# Altium schematic sheet part_2.SchDoc
size A4; SheetNumber: 2; SheetTotal: 2
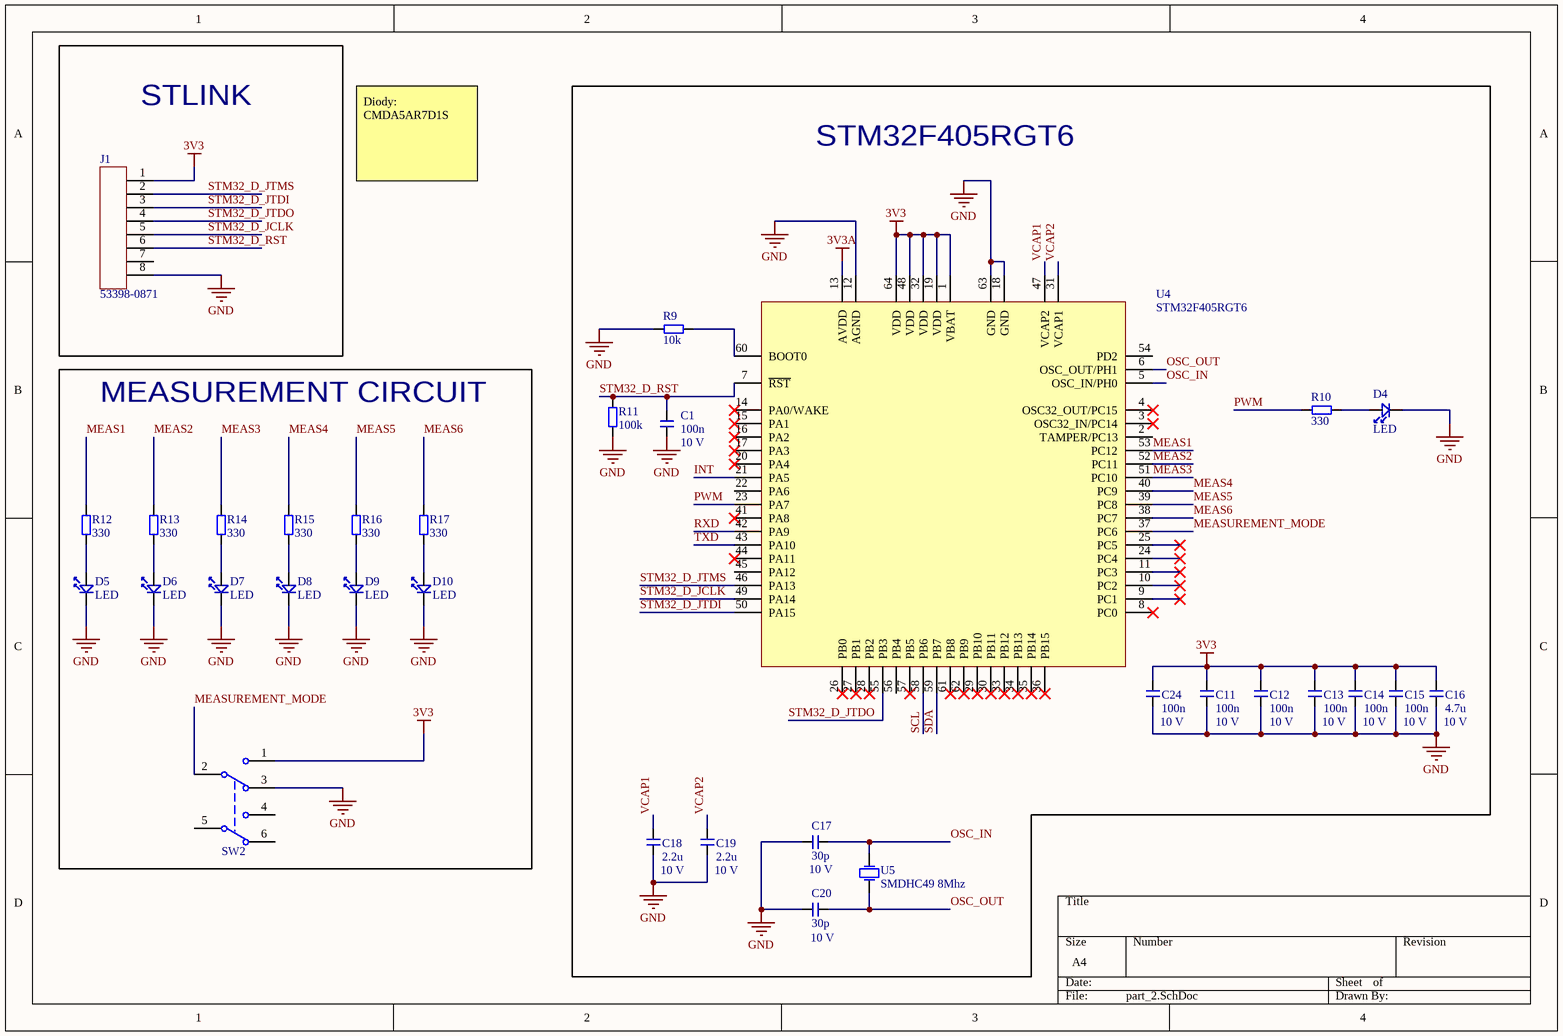
[diagram p0: part_2.SchDoc]

## Parts
C1  100n  V: 10 V  [0603]
C11  100n  V: 10 V  [0603]
C12  100n  V: 10 V  [0603]
C13  100n  V: 10 V  [0603]
C14  100n  V: 10 V  [0603]
C15  100n  V: 10 V  [0603]
C16  4.7u  V: 10 V  [0603]
C17  30p  V: 10 V  [0603]
C18  2.2u  V: 10 V  [0603]
C19  2.2u  V: 10 V  [0603]
C20  30p  V: 10 V  [0603]
C24  100n  V: 10 V  [0603]
D4  LED  [Dioda_0805]
D5  LED  [Dioda_0805]
D6  LED  [Dioda_0805]
D7  LED  [Dioda_0805]
D8  LED  [Dioda_0805]
D9  LED  [Dioda_0805]
D10  LED  [Dioda_0805]
J1  53398-0871  [53398-0871]
R9  10k  [0603]
R10  330  [0603]
R11  100k  [0603]
R12  330  [0603]
R13  330  [0603]
R14  330  [0603]
R15  330  [0603]
R16  330  [0603]
R17  330  [0603]
SW2  452403012014  [452403012014]  (value not drawn)
U4  STM32F405RGT6  [LQFP 64 0.5]
U5  SMDHC49 8Mhz  [SMDHC_49]

## Blocks framed on the sheet
STLINK: J1
STM32F405RGT6: C1 C11-C20 C24 D4 R9-R11 U4 U5
MEASUREMENT CIRCUIT: D5-D10 R12-R17 SW2

## Nets
3V3: C11.2 C12.2 C13.2 C14.2 C15.2 C16.2 C24.2 J1.1 SW2.1 U4.1(VBAT) U4.19(VDD) U4.32(VDD) U4.48(VDD) U4.64(VDD)
3V3A: U4.13(AVDD)
GND: C1.1 C11.1 C12.1 C13.1 C14.1 C15.1 C16.1 C17.2 C18.1 C19.1 C20.2 C24.1 D4.1 D5.1 D6.1 D7.1 D8.1 D9.1 D10.1 J1.8 R9.1 R11.1 SW2.3 U4.12(AGND) U4.18(GND) U4.63(GND)
INT: U4.21(PA5)
MEAS1: R12.2 U4.53(PC12)
MEAS2: R13.2 U4.52(PC11)
MEAS3: R14.2 U4.51(PC10)
MEAS4: R15.2 U4.40(PC9)
MEAS5: R16.2 U4.39(PC8)
MEAS6: R17.2 U4.38(PC7)
MEASUREMENT_MODE: SW2.2(COM) U4.37(PC6)
OSC_IN: C17.1 U4.5(OSC_IN/PH0) U5.2(OSC2)
OSC_OUT: C20.1 U4.6(OSC_OUT/PH1) U5.1(OSC1)
PWM: R10.1 U4.23(PA7)
RXD: U4.42(PA9)
SCL: U4.58(PB6)
SDA: U4.59(PB7)
STM32_D_JCLK: J1.5 U4.49(PA14)
STM32_D_JTDI: J1.3 U4.50(PA15)
STM32_D_JTDO: J1.4 U4.55(PB3)
STM32_D_JTMS: J1.2 U4.46(PA13)
STM32_D_RST: C1.2 J1.6 R11.2 U4.7(~{RST})
TXD: U4.43(PA10)
VCAP1: C18.2 U4.47(VCAP2)
VCAP2: C19.2 U4.31(VCAP1)
NetD4_2: D4.2 R10.2
NetD5_2: D5.2 R12.1
NetD6_2: D6.2 R13.1
NetD7_2: D7.2 R14.1
NetD8_2: D8.2 R15.1
NetD9_2: D9.2 R16.1
NetD10_2: D10.2 R17.1
NetR9_2: R9.2 U4.60(BOOT0)

Not connected (* = marked no-connect by the designer): J1 7; SW2 4 5(COM) 6; U4 2(TAMPER/PC13) 3(OSC32_IN/PC14)* 4(OSC32_OUT/PC15)* 8(PC0)* 9(PC1)* 10(PC2)* 11(PC3)* 14(PA0/WAKE)* 15(PA1)* 16(PA2)* 17(PA3)* 20(PA4)* 22(PA6) 24(PC4)* 25(PC5)* 26(PB0)* 27(PB1)* 28(PB2)* 29(PB10)* 30(PB11)* 33(PB12)* 34(PB13)* 35(PB14)* 36(PB15)* 41(PA8)* 44(PA11)* 45(PA12) 54(PD2) 56(PB4) 57(PB5)* 61(PB8)* 62(PB9)*

## Notes on the sheet
- Diody: CMDA5AR7D1S

## Library data of the parts
C1 C11-C20 C24 = CapN: kondensator ceramiczny
D4-D10 = Dioda_LED: Dioda LED SMD
J1 = CON8: Molex PicoBlade 8pin; Producent: Molex
R9-R17 = Res: Rezystor SMD
SW2 = 452403012014: WS-SLSV SMT Mini Slide Switch, Same Side Connection, DPDT, 6VDC, 300mA, 350g; Manufacturer: Wurth Elektronik; ComponentLink1Description: Website Link; ComponentLink1URL: https://www.we-online.com/redexpert/article/452403012014?ad; ComponentLink2Description: Datasheet Link; ComponentLink2URL: https://www.we-online.com/redexpert/spec/452403012014?ad; Manufacturer Part Number: 452403012014; Category: Slide Switches; Match Code: WS-SLSV; Mount: Surface Mount; Operating Temperature Max: 85°C; Operating Temperature Min: -40°C; Packaging: Tape and Reel; Length: 7.7mm; Width: 5.5mm; Height: 3.3mm; Circuit: DPDT; Contact Material: Copper Alloy; Contact Plating: Silver; Operation Force: 350g; Rated Current: 300mA; Rated Voltage: 6VDC; Terminal Material: Copper Alloy; Terminal Plating: Silver
U4 = STM32F415RGT6: STM32F415, 64 leads, LQFP
U5 = kwarc: rezonator kwarcowy